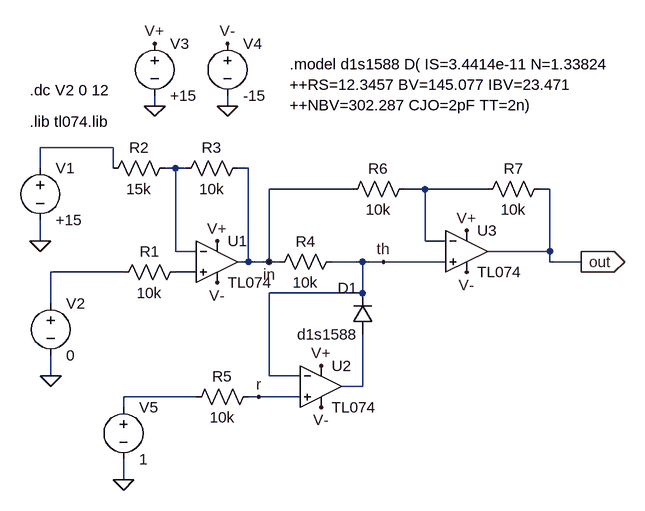
[diagram p0: schematic fig26P0-1V.asc]
fig26P0-1V.asc, the LTspice schematic file:
Version 4
SHEET 1 924 680
WIRE 112 -96 112 -112
WIRE 224 -96 224 -112
WIRE 48 -32 -64 -32
WIRE -64 0 -64 -32
WIRE 48 0 48 -32
WIRE 144 0 128 0
WIRE 160 0 144 0
WIRE 256 0 240 0
WIRE 416 32 288 32
WIRE 528 32 496 32
WIRE 624 32 528 32
WIRE 720 32 704 32
WIRE -64 112 -64 80
WIRE 528 112 528 32
WIRE 560 112 528 112
WIRE 144 128 144 0
WIRE 176 128 144 128
WIRE 720 128 720 32
WIRE 720 128 624 128
WIRE 256 144 256 0
WIRE 256 144 240 144
WIRE 288 144 288 32
WIRE 288 144 256 144
WIRE 304 144 288 144
WIRE 432 144 384 144
WIRE 464 144 432 144
WIRE 560 144 464 144
WIRE 720 144 720 128
WIRE 768 144 720 144
WIRE 64 160 -48 160
WIRE 176 160 144 160
WIRE 432 192 432 144
WIRE 432 192 288 192
WIRE -48 208 -48 160
WIRE -48 320 -48 288
WIRE 288 320 288 192
WIRE 336 320 288 320
WIRE 432 336 432 256
WIRE 432 336 400 336
WIRE 176 352 64 352
WIRE 272 352 256 352
WIRE 336 352 272 352
WIRE 64 368 64 352
WIRE 64 480 64 448
FLAG -64 112 0
FLAG -48 320 0
FLAG 64 480 0
FLAG 768 144 out
IOPIN 768 144 Out
FLAG 112 -96 0
FLAG 224 -96 0
FLAG 112 -192 V+
FLAG 224 -192 V-
FLAG 208 112 V+
FLAG 208 176 V-
FLAG 288 144 in
FLAG 368 304 V+
FLAG 368 368 V-
FLAG 592 96 V+
FLAG 592 160 V-
FLAG 272 352 r
FLAG 464 144 th
SYMBOL Opamps\\opamp2 208 80 R0
SYMATTR InstName U1
SYMATTR Value TL074
SYMBOL res 48 176 R270
WINDOW 0 32 56 VTop 0
WINDOW 3 0 56 VBottom 0
SYMATTR InstName R1
SYMATTR Value 10k
SYMBOL res 32 16 R270
WINDOW 0 32 56 VTop 0
WINDOW 3 0 56 VBottom 0
SYMATTR InstName R2
SYMATTR Value 15k
SYMBOL res 144 16 R270
WINDOW 0 32 56 VTop 0
WINDOW 3 0 56 VBottom 0
SYMATTR InstName R3
SYMATTR Value 10k
SYMBOL res 288 160 R270
WINDOW 0 32 56 VTop 0
WINDOW 3 0 56 VBottom 0
SYMATTR InstName R4
SYMATTR Value 10k
SYMBOL voltage -64 -16 R0
WINDOW 123 0 0 Left 0
WINDOW 39 0 0 Left 0
SYMATTR InstName V1
SYMATTR Value +15
SYMBOL voltage -48 192 R0
WINDOW 123 0 0 Left 0
WINDOW 39 0 0 Left 0
SYMATTR InstName V2
SYMATTR Value 0
SYMBOL diode 448 256 R180
WINDOW 0 24 72 Left 0
WINDOW 3 24 0 Left 0
SYMATTR InstName D1
SYMATTR Value d1s1588
SYMBOL voltage 112 -208 R0
SYMATTR InstName V3
SYMATTR Value +15
SYMBOL voltage 224 -208 R0
SYMATTR InstName V4
SYMATTR Value -15
SYMBOL Opamps\\opamp2 368 272 R0
SYMATTR InstName U2
SYMATTR Value TL074
SYMBOL res 160 368 R270
WINDOW 0 32 56 VTop 0
WINDOW 3 0 56 VBottom 0
SYMATTR InstName R5
SYMATTR Value 10k
SYMBOL res 400 48 R270
WINDOW 0 32 56 VTop 0
WINDOW 3 0 56 VBottom 0
SYMATTR InstName R6
SYMATTR Value 10k
SYMBOL res 608 48 R270
WINDOW 0 32 56 VTop 0
WINDOW 3 0 56 VBottom 0
SYMATTR InstName R7
SYMATTR Value 10k
SYMBOL Opamps\\opamp2 592 64 R0
SYMATTR InstName U3
SYMATTR Value TL074
SYMBOL voltage 64 352 R0
WINDOW 123 0 0 Left 0
WINDOW 39 0 0 Left 0
SYMATTR InstName V5
SYMATTR Value 1
TEXT -80 -120 Left 0 !.dc V2 0 12 
TEXT -80 -72 Left 0 !.lib tl074.lib
TEXT 320 -160 Left 0 !.model d1s1588 D( IS=3.4414e-11 N=1.33824 \n++RS=12.3457 BV=145.077 IBV=23.471 \n++NBV=302.287 CJO=2pF TT=2n)

The netlist it stands for:
* fig26P0-1V.asc
XU1 N005 N002 V+ V- in TL074  ; pins In+ In- V+ V- OUT
R1 N004 N005 10k
R2 N001 N002 15k
R3 N002 in 10k
R4 in th 10k
V1 N001 0 +15
V2 N004 0 0
D1 N006 th d1s1588
V3 V+ 0 +15
V4 V- 0 -15
XU2 r th V+ V- N006 TL074  ; pins In+ In- V+ V- OUT
R5 N007 r 10k
R6 in N003 10k
R7 N003 out 10k
XU3 th N003 V+ V- out TL074  ; pins In+ In- V+ V- OUT
V5 N007 0 1
.model D D
.lib standard.dio
.dc V2 0 12
.lib tl074.lib
.model d1s1588 D( IS=3.4414e-11 N=1.33824
++RS=12.3457 BV=145.077 IBV=23.471
++NBV=302.287 CJO=2pF TT=2n)
.backanno
.end